# EAGLE design TSOP-II-44_v3_E6.6 (EAGLE 6.6.0)
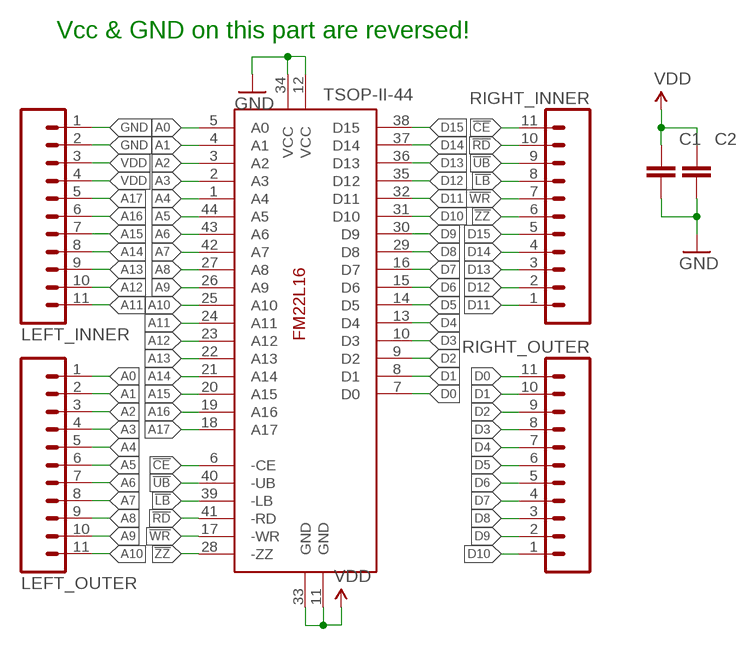
[diagram p0: schematic, sheet 1]

## Parts
C1  CAPACITOR_NPOL-0603  [C603]
C2  CAPACITOR_NPOL-0603  [C603]
LEFT_INNER  M11PTH  [1X11]
LEFT_OUTER  M11PTH  [1X11]
RIGHT_INNER  M11PTH  [1X11]
RIGHT_OUTER  M11PTH  [1X11]
TSOP-II-44  FM22L16-TG  [TSOPII-44]

## Nets
!CE: RIGHT_INNER.11 TSOP-II-44.6(-CE)
!LB: RIGHT_INNER.8 TSOP-II-44.39(-LB)
!RD: RIGHT_INNER.10 TSOP-II-44.41(-RD)
!UB: RIGHT_INNER.9 TSOP-II-44.40(-UB)
!WR: RIGHT_INNER.7 TSOP-II-44.17(-WR)
!ZZ: RIGHT_INNER.6 TSOP-II-44.28(-ZZ)
A0: LEFT_OUTER.1 TSOP-II-44.5(A0)
A1: LEFT_OUTER.2 TSOP-II-44.4(A1)
A2: LEFT_OUTER.3 TSOP-II-44.3(A2)
A3: LEFT_OUTER.4 TSOP-II-44.2(A3)
A4: LEFT_OUTER.5 TSOP-II-44.1(A4)
A5: LEFT_OUTER.6 TSOP-II-44.44(A5)
A6: LEFT_OUTER.7 TSOP-II-44.43(A6)
A7: LEFT_OUTER.8 TSOP-II-44.42(A7)
A8: LEFT_OUTER.9 TSOP-II-44.27(A8)
A9: LEFT_OUTER.10 TSOP-II-44.26(A9)
A10: LEFT_OUTER.11 TSOP-II-44.25(A10)
A11: LEFT_INNER.11 TSOP-II-44.24(A11)
A12: LEFT_INNER.10 TSOP-II-44.23(A12)
A13: LEFT_INNER.9 TSOP-II-44.22(A13)
A14: LEFT_INNER.8 TSOP-II-44.21(A14)
A15: LEFT_INNER.7 TSOP-II-44.20(A15)
A16: LEFT_INNER.6 TSOP-II-44.19(A16)
A17: LEFT_INNER.5 TSOP-II-44.18(A17)
D0: RIGHT_OUTER.11 TSOP-II-44.7(D0)
D1: RIGHT_OUTER.10 TSOP-II-44.8(D1)
D2: RIGHT_OUTER.9 TSOP-II-44.9(D2)
D3: RIGHT_OUTER.8 TSOP-II-44.10(D3)
D4: RIGHT_OUTER.7 TSOP-II-44.13(D4)
D5: RIGHT_OUTER.6 TSOP-II-44.14(D5)
D6: RIGHT_OUTER.5 TSOP-II-44.15(D6)
D7: RIGHT_OUTER.4 TSOP-II-44.16(D7)
D8: RIGHT_OUTER.3 TSOP-II-44.29(D8)
D9: RIGHT_OUTER.2 TSOP-II-44.30(D9)
D10: RIGHT_OUTER.1 TSOP-II-44.31(D10)
D11: RIGHT_INNER.1 TSOP-II-44.32(D11)
D12: RIGHT_INNER.2 TSOP-II-44.35(D12)
D13: RIGHT_INNER.3 TSOP-II-44.36(D13)
D14: RIGHT_INNER.4 TSOP-II-44.37(D14)
D15: RIGHT_INNER.5 TSOP-II-44.38(D15)
GND: C1.2 C2.2 LEFT_INNER.1 LEFT_INNER.2 TSOP-II-44.12(VCC) TSOP-II-44.34(VCC)
VDD: C1.1 C2.1 LEFT_INNER.3 LEFT_INNER.4 TSOP-II-44.11(GND) TSOP-II-44.33(GND)

## Notes on the sheet
- Vcc & GND on this part are reversed!

## Library data of the parts
C1 C2 = dp_devices:CAPACITOR_NPOL: Non-Polarized capacitor in various packages
LEFT_INNER LEFT_OUTER RIGHT_INNER RIGHT_OUTER = SparkFun-Connectors:M11: Header 11 Standard 11-pin 0.1" header. Use with straight break away headers (SKU : PRT-00116), right angle break away headers (PRT-00553), swiss pins (PRT-00743), machine pins (PRT-00117), and female headers (PRT-00115).
TSOP-II-44 = ramtron:FM22L16: NVRAM 256k x 16 or 512k x 8

## Board
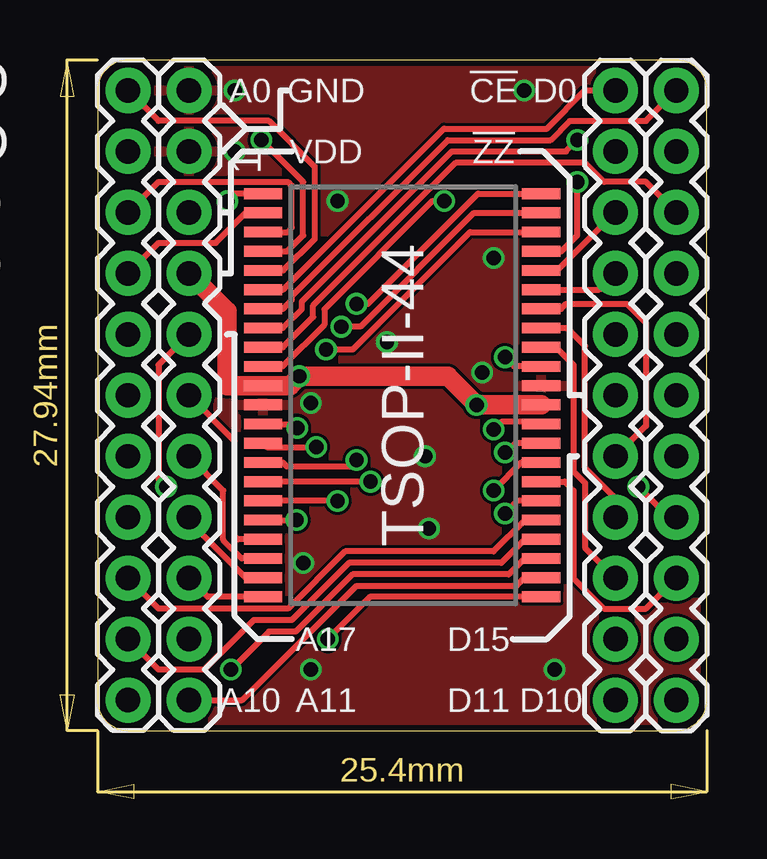
[diagram p1: board, top side]
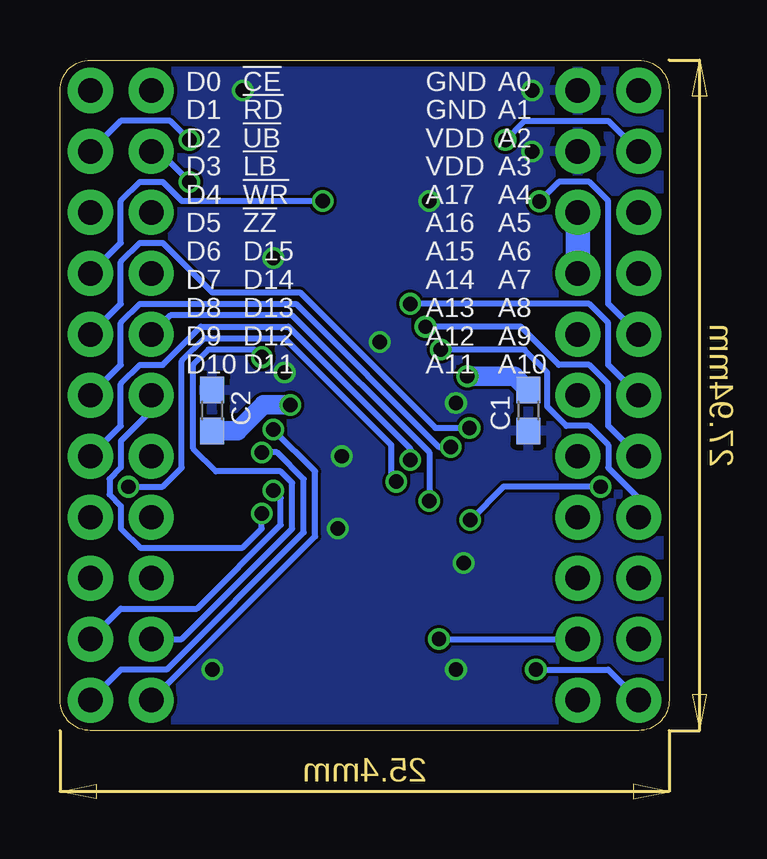
[diagram p2: board, bottom side, seen from below]

Size 25.4 x 27.94 mm. Coordinates in mm from the lower left corner, seen from the top.
Outline: 0,26.67 0,1.27 arc90 1.27,0 24.13,0 arc90 25.4,1.27 25.4,26.67 arc90 24.13,27.94 1.27,27.94 arc90 0,26.67
Copper layers (1*16): Top 0.035mm / dielectric 1.5mm / Bottom 0.035mm
Design rules "dirt_cheap_dirty_boards.v1": minimum track width 5mil, minimum drill 12mil, track to track 5mil, track to pad 5mil, pad to pad 5mil, via to via 5mil, smd to smd 0mil, copper to edge 10mil, drill to drill 10mil, minimum pad ring 10mil, minimum via ring 6mil, stop-mask expansion 2mil, vias tented up to drill 25mil, thermal gap 10mil

### Footprints (pad centres in the part's own frame; a part is rotated, then mirrored left to right if it is on the bottom)
C603 = smd 1.1 x 1: 1 -0.85,0; 2 0.85,0
1X11 = drill 1.016 pad 1.88: 1 0,0; 2 2.54,0; 3 5.08,0; 4 7.62,0; 5 10.16,0; 6 12.7,0; 7 15.24,0; 8 17.78,0; 9 20.32,0; 10 22.86,0; 11 25.4,0
TSOPII-44 = smd 0.45 x 1.6: 1 -8.4,-5.8; 2 -7.6,-5.8; 3 -6.8,-5.8; 4 -6,-5.8; 5 -5.2,-5.8; 6 -4.4,-5.8; 7 -3.6,-5.8; 8 -2.8,-5.8; 9 -2,-5.8; 10 -1.2,-5.8; 11 -0.4,-5.8; 12 0.4,-5.8; 13 1.2,-5.8; 14 2,-5.8; 15 2.8,-5.8; 16 3.6,-5.8; 17 4.4,-5.8; 18 5.2,-5.8; 19 6,-5.8; 20 6.8,-5.8; 21 7.6,-5.8; 22 8.4,-5.8; 23 8.4,5.8; 24 7.6,5.8; 25 6.8,5.8; 26 6,5.8; 27 5.2,5.8; 28 4.4,5.8; 29 3.6,5.8; 30 2.8,5.8; 31 2,5.8; 32 1.2,5.8; 33 0.4,5.8; 34 -0.4,5.8; 35 -1.2,5.8; 36 -2,5.8; 37 -2.8,5.8; 38 -3.6,5.8; 39 -4.4,5.8; 40 -5.2,5.8; 41 -6,5.8; 42 -6.8,5.8; 43 -7.6,5.8; 44 -8.4,5.8

### Placement (x,y rotation side)
C1  5.87,13.34 270 bottom
C2  19.05,13.34 90 bottom
LEFT_INNER  3.81,26.67 270 top
LEFT_OUTER  1.27,26.67 270 top
RIGHT_INNER  21.59,1.27 90 top
RIGHT_OUTER  24.13,1.27 90 top
TSOP-II-44  12.7,13.97 270 top

### Tracks (layer width: path | path; a pad name or v marks a point on that pad's centre or on a via)
!CE
  Top 0.254: TSOP-II-44.6 7.73,18.37 14.45,25.08 18.73,25.08 20.32,26.67 RIGHT_INNER.11
!LB
  Top 0.254: TSOP-II-44.39 20.91,18.37 RIGHT_INNER.8
!RD  (via drill 0.6)
  Top 0.254: TSOP-II-44.41 19.34,19.97 20,20.64 v20,22.86
  Bottom 0.254: v20,22.86 21.27,24.13 RIGHT_INNER.10
!UB
  Top 0.254: TSOP-II-44.40 19.17,19.17 RIGHT_INNER.9
!WR  (via drill 0.6)
  Top 0.254: v10,9.57 TSOP-II-44.17
  Bottom 0.254: RIGHT_INNER.7 20.8,17.3 15.72,17.3 10,11.59 v10,9.57
!ZZ  (via drill 0.6)
  Top 0.254: TSOP-II-44.28 17.51,9.57 v16.99,9.05
  Bottom 0.254: RIGHT_INNER.6 21.59,13.34 22.86,12.06 22.86,10.95 23.34,10.48 23.34,9.84 22.86,9.37 22.86,8.41 22.07,7.62 17.78,7.62 16.99,8.41 v16.99,9.05
A0
  Top 0.254: LEFT_OUTER.1 2.54,25.4 7.14,25.4 9.05,23.5 9.05,20.48 7.74,19.17 TSOP-II-44.5
A1  (via drill 0.6)
  Top 0.254: v6.83,24.61 8.57,22.86 8.57,20.64 7.91,19.97 TSOP-II-44.4
  Bottom 0.254: v6.83,24.61 6.03,25.4 2.54,25.4 LEFT_OUTER.2
A2
  Top 0.254: TSOP-II-44.3 7.91,20.77 8.1,20.95 8.1,22.7 7.94,22.86 2.54,22.86 LEFT_OUTER.3
A3
  Top 0.254: LEFT_OUTER.4 2.54,20.32 4.92,20.32 6.17,21.57 TSOP-II-44.2
A4  (via drill 0.6)
  Top 0.254: TSOP-II-44.1 5.73,22.37 v5.41,22.05
  Bottom 0.254: LEFT_OUTER.5 2.54,17.78 2.54,22.07 3.33,22.86 4.6,22.86 v5.41,22.05
A5  (via drill 0.6)
  Top 0.254: TSOP-II-44.44 15.86,22.37 11.27,17.78 v10.79,17.78
  Bottom 0.254: LEFT_OUTER.6 2.54,15.24 2.54,16.99 3.33,17.78 v10.79,17.78
A6  (via drill 0.6)
  Top 0.254: TSOP-II-44.43 15.7,21.57 10.95,16.83 v10.16,16.83
  Bottom 0.254: LEFT_OUTER.7 2.54,12.7 2.54,14.45 3.33,15.24 4.6,15.24 6.19,16.83 v10.16,16.83
A7  (via drill 0.6)
  Top 0.254: TSOP-II-44.42 15.53,20.77 10.64,15.88 v9.53,15.88
  Bottom 0.254: v9.53,15.88 6.03,15.88 5.08,14.92 5.08,13.49 4.29,12.7 3.33,12.7 2.54,11.91 2.54,10.95 1.27,9.68 LEFT_OUTER.8
A8
  Top 0.254: LEFT_OUTER.9 2.54,5.08 7.94,5.08 10.32,7.46 16.51,7.46 17.82,8.77 TSOP-II-44.27
A9
  Top 0.254: LEFT_OUTER.10 2.54,2.54 4.45,2.54 6.51,4.6 8.1,4.6 10.48,6.99 16.83,6.99 17.81,7.97 TSOP-II-44.26
A10  (via drill 0.6)
  Top 0.254: TSOP-II-44.25 17.81,7.17 17.14,6.51 10.64,6.51 8.26,4.13 7.14,4.13 v5.56,2.54
  Bottom 0.254: v5.56,2.54 2.54,2.54 LEFT_OUTER.11
A11
  Top 0.254: 18.48,6.35 TSOP-II-44.24 17.8,6.37 17.46,6.03 10.79,6.03 6.03,1.27 LEFT_INNER.11
A12  (via drill 0.6)
  Top 0.254: TSOP-II-44.23 11.36,5.57 v9.6,3.81
  Bottom 0.254: v9.6,3.81 LEFT_INNER.10
A13
  Top 0.254: TSOP-II-44.22 4.59,5.57 LEFT_INNER.9
A14
  Top 0.254: TSOP-II-44.21 6.17,6.37 3.81,8.73 LEFT_INNER.8
A15
  Top 0.254: TSOP-II-44.20 6.01,7.17 5.24,7.94 5.24,10 LEFT_INNER.7
A16
  Top 0.254: TSOP-II-44.19 5.84,7.97 5.71,8.1 5.71,12.06 LEFT_INNER.6
A17  (via drill 0.6)
  Top 0.254: LEFT_INNER.5 2.54,15.24 2.54,10.48 v2.86,10.16 | TSOP-II-44.18 v8.29,8.77
  Bottom 0.254: v2.86,10.16 6.9,10.16 v8.29,8.77
D0
  Top 0.254: RIGHT_OUTER.11 22.86,25.4 19.68,25.4 18.89,24.61 14.61,24.61 8.1,18.1 8.1,17.94 7.73,17.57 TSOP-II-44.7
D1  (via drill 0.6)
  Top 0.254: v20,24.61 19.53,24.13 14.76,24.13 8.52,17.88 8.52,17.56 7.72,16.77 TSOP-II-44.8
  Bottom 0.254: v20,24.61 20.8,25.4 22.86,25.4 RIGHT_OUTER.10
D2
  Top 0.254: RIGHT_OUTER.9 22.86,22.86 21.11,22.86 20.32,23.65 14.92,23.65 8.98,17.72 8.98,17.24 7.71,15.97 TSOP-II-44.9
D3  (via drill 0.6)
  Top 0.254: v14.45,22.07 13.97,22.07 9.46,17.55 9.46,16.92 7.71,15.17 TSOP-II-44.10
  Bottom 0.254: RIGHT_OUTER.8 22.86,20.32 22.86,22.07 22.07,22.86 21.11,22.86 20.32,22.07 v14.45,22.07
D4  (via drill 0.6)
  Top 0.254: TSOP-II-44.13 8.17,12.77 v8.32,12.61
  Bottom 0.254: v8.32,12.61 9.75,12.61 15.4,18.26 19.05,18.26 21.11,20.32 22.07,20.32 22.86,19.53 22.86,17.78 RIGHT_OUTER.7
D5  (via drill 0.6)
  Top 0.254: TSOP-II-44.14 7.06,11.81 v9.11,11.81
  Bottom 0.254: RIGHT_OUTER.6 22.86,15.24 22.86,16.99 22.07,17.78 15.56,17.78 9.59,11.81 v9.11,11.81
D6  (via drill 0.6)
  Top 0.254: TSOP-II-44.15 7.72,11.17 7.88,11.01 10.54,11.01 v10.79,11.27
  Bottom 0.254: RIGHT_OUTER.5 22.86,12.7 22.86,14.45 22.07,15.24 21.11,15.24 19.53,16.83 15.88,16.83 10.79,11.75 v10.79,11.27
D7  (via drill 0.6)
  Top 0.254: v11.38,10.37 TSOP-II-44.16 | RIGHT_OUTER.4 23.81,8.89 v22.54,10.16
  Bottom 0.254: v22.54,10.16 21.11,10.16 20.32,10.95 20.32,15.4 19.37,16.35 16.03,16.35 11.59,11.91 11.59,10.58 v11.38,10.37
D8
  Top 0.254: TSOP-II-44.29 19.48,10.37 19.84,10 19.84,6.35 21.11,5.08 22.86,5.08 RIGHT_OUTER.3
D9  (via drill 0.6)
  Top 0.254: TSOP-II-44.30 17.68,11.17 v16.51,10
  Bottom 0.254: RIGHT_OUTER.2 22.86,5.08 19.68,5.08 16.19,8.57 16.19,9.68 v16.51,10
D10  (via drill 0.6)
  Top 0.254: TSOP-II-44.31 17.4,11.97 v16.99,11.59
  Bottom 0.254: v16.99,11.59 16.35,11.59 15.24,10.48 15.24,8.26 20.95,2.54 22.86,2.54 RIGHT_OUTER.1
D11  (via drill 0.6)
  Top 0.254: TSOP-II-44.32 18.41,12.86 16.83,12.86 v16.51,12.54
  Bottom 0.254: RIGHT_INNER.1 14.76,8.1 14.76,10.79 v16.51,12.54
D12  (via drill 0.6)
  Top 0.254: TSOP-II-44.35 17.37,15.17 v16.99,15.56
  Bottom 0.254: RIGHT_INNER.2 20.32,3.81 15.72,8.41 15.72,10.32 16.19,10.79 18.89,10.79 19.84,11.75 19.84,15.24 19.21,15.88 17.3,15.88 v16.99,15.56
D13
  Top 0.254: RIGHT_INNER.3 20.32,7.62 20.32,10.32 19.84,10.79 19.84,15.24 19.11,15.97 TSOP-II-44.36
D14
  Top 0.254: RIGHT_INNER.4 21.59,9.68 20.32,10.95 20.32,16.03 19.58,16.77 TSOP-II-44.37
D15
  Top 0.254: RIGHT_INNER.5 22.86,12.7 22.86,16.99 22.07,17.78 19.53,17.78 19.32,17.57 TSOP-II-44.38
GND  (via drill 0.6)
  other vias: 5.71,26.67 19.05,2.54 5.71,24.13 17.78,26.67 10,22.07 16.51,19.68 8.89,13.65 8.57,6.99 13.65,11.43 13.81,8.41 16.03,14.92 8.89,2.54 12.06,16.19
  pour Bottom: 0,27.94 25.4,27.94 25.4,0 0,0
  pour Top: 0,27.94 25.4,27.94 25.4,0 0,0
VDD  (via drill 0.6)
  Top 0.813: LEFT_INNER.4 5.4,17.46 5.4,14.37 TSOP-II-44.11 8.02,14.37 v8.41,14.76 14.61,14.76 v15.8,13.57 TSOP-II-44.33
  Bottom 0.813: C1.1 6.45,14.76 v8.41,14.76 | C2.1 18,12.48 16.91,13.57 v15.8,13.57
  Bottom 1.016: LEFT_INNER.3 LEFT_INNER.4

### Text on the board
tPlace: A0 / A1 / A2 / A3 / A4 / A5 / A6 / A7 / A8 / A9 / A10 | GND / GND / VDD / VDD / A17 / A16 / A15 / A14 / A13 / A12 / A11 | !CE / !RD / !UB / !LB / !WR / !ZZ / D15 / D14 / D13 / D12 / D11 | D0 / D1 / D2 / D3 / D4 / D5 / D6 / D7 / D8 / D9 / D10
bPlace: A0 / A1 / A2 / A3 / A4 / A5 / A6 / A7 / A8 / A9 / A10 | GND / GND / VDD / VDD / A17 / A16 / A15 / A14 / A13 / A12 / A11 | !CE / !RD / !UB / !LB / !WR / !ZZ / D15 / D14 / D13 / D12 / D11 | D0 / D1 / D2 / D3 / D4 / D5 / D6 / D7 / D8 / D9 / D10
tNames: A0 | GND | !CE | D0 | VDD | !ZZ | A17 | D15 | A10 | A11 | D11 | D10